# Altium schematic sheet MCU Power.SchDoc
size A3; Author: ALP Electronics; CompanyName: ALP Electronics; DrawnBy: Caner Alp; Engineer: Caner Alp; Organization: ALP Electronics; Address2: Västerås; Address4: Sweden; SheetNumber: 3; SheetTotal: 3
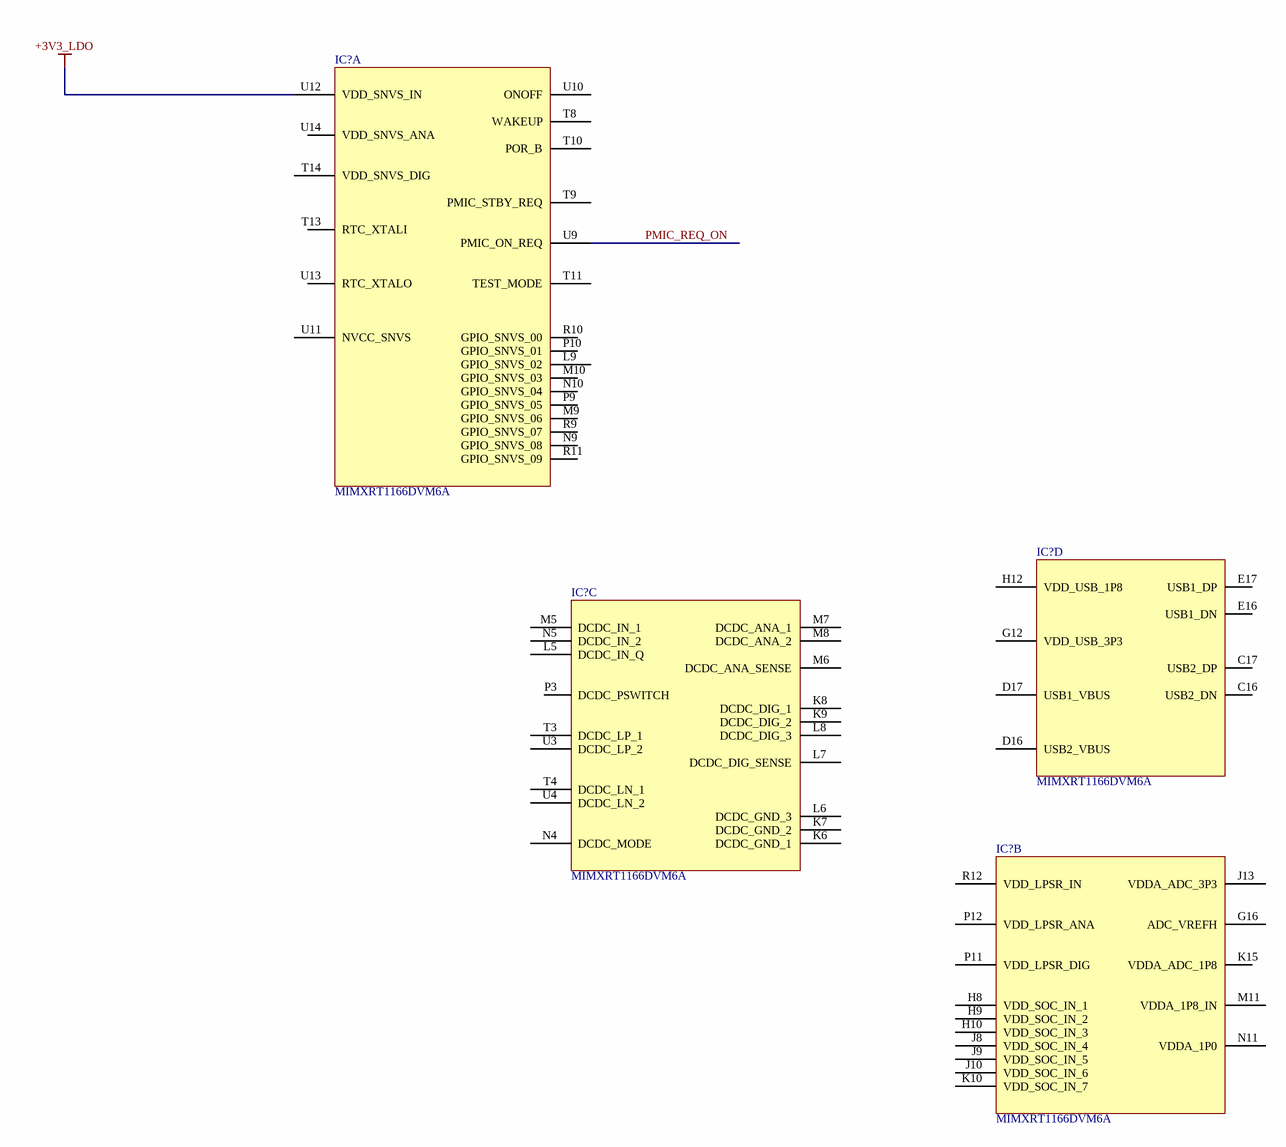
[diagram p0: MCU Power.SchDoc]

## Parts
(Parts that share a designator on the sheet are numbered #1, #2 ... from top to bottom, then left to right.)
IC?#1  MIMXRT1166DVM6A  [BGA289C80P17X17_1400X1400X152]  (part A of 12)
IC?#2  MIMXRT1166DVM6A  [BGA289C80P17X17_1400X1400X152]  (part D of 12)
IC?#3  MIMXRT1166DVM6A  [BGA289C80P17X17_1400X1400X152]  (part C of 12)
IC?#4  MIMXRT1166DVM6A  [BGA289C80P17X17_1400X1400X152]  (part B of 12)

## Nets
+3V3_LDO: IC?#1.U12(VDD_SNVS_IN)
PMIC_REQ_ON: IC?#1.U9(PMIC_ON_REQ)

Not connected (* = marked no-connect by the designer): IC?#1 L9(GPIO_SNVS_02) M9(GPIO_SNVS_06) M10(GPIO_SNVS_03) N9(GPIO_SNVS_08) N10(GPIO_SNVS_04) P9(GPIO_SNVS_05) P10(GPIO_SNVS_01) R9(GPIO_SNVS_07) R10(GPIO_SNVS_00) R11(GPIO_SNVS_09) T8(WAKEUP) T9(PMIC_STBY_REQ) T10(POR_B) T11(TEST_MODE) T13(RTC_XTALI) T14(VDD_SNVS_DIG) U10(ONOFF) U11(NVCC_SNVS) U13(RTC_XTALO) U14(VDD_SNVS_ANA); IC?#2 C16(USB2_DN) C17(USB2_DP) D16(USB2_VBUS) D17(USB1_VBUS) E16(USB1_DN) E17(USB1_DP) G12(VDD_USB_3P3) H12(VDD_USB_1P8); IC?#3 K6(DCDC_GND_1) K7(DCDC_GND_2) K8(DCDC_DIG_1) K9(DCDC_DIG_2) L5(DCDC_IN_Q) L6(DCDC_GND_3) L7(DCDC_DIG_SENSE) L8(DCDC_DIG_3) M5(DCDC_IN_1) M6(DCDC_ANA_SENSE) M7(DCDC_ANA_1) M8(DCDC_ANA_2) N4(DCDC_MODE) N5(DCDC_IN_2) P3(DCDC_PSWITCH) T3(DCDC_LP_1) T4(DCDC_LN_1) U3(DCDC_LP_2) U4(DCDC_LN_2); IC?#4 G16(ADC_VREFH) H8(VDD_SOC_IN_1) H9(VDD_SOC_IN_2) H10(VDD_SOC_IN_3) J8(VDD_SOC_IN_4) J9(VDD_SOC_IN_5) J10(VDD_SOC_IN_6) J13(VDDA_ADC_3P3) K10(VDD_SOC_IN_7) K15(VDDA_ADC_1P8) M11(VDDA_1P8_IN) N11(VDDA_1P0) P11(VDD_LPSR_DIG) P12(VDD_LPSR_ANA) R12(VDD_LPSR_IN)

## Notes on the sheet
- Title:
- Size:
- Project:
- A3
- Date:
- Revision:
- Drawn By:
- Sheet
- of

## Library data of the parts
IC?#1-IC?#4 = MIMXRT1166DVM6A: Integrated Circuit; Manufacturer_Name: NXP; Datasheet Link: https://www.mouser.in/datasheet/2/302/IMXRT1160CEC-2335852.pdf; Height: 1.52mm; Manufacturer_Part_Number: MIMXRT1166DVM6A; Mouser Part Number: 771-MIMXRT1166DVM6A; Mouser Price/Stock: https://www.mouser.co.uk/ProductDetail/NXP-Semiconductors/MIMXRT1166DVM6A?qs=DRkmTr78QARbPfoaiaD1vg%3D%3D